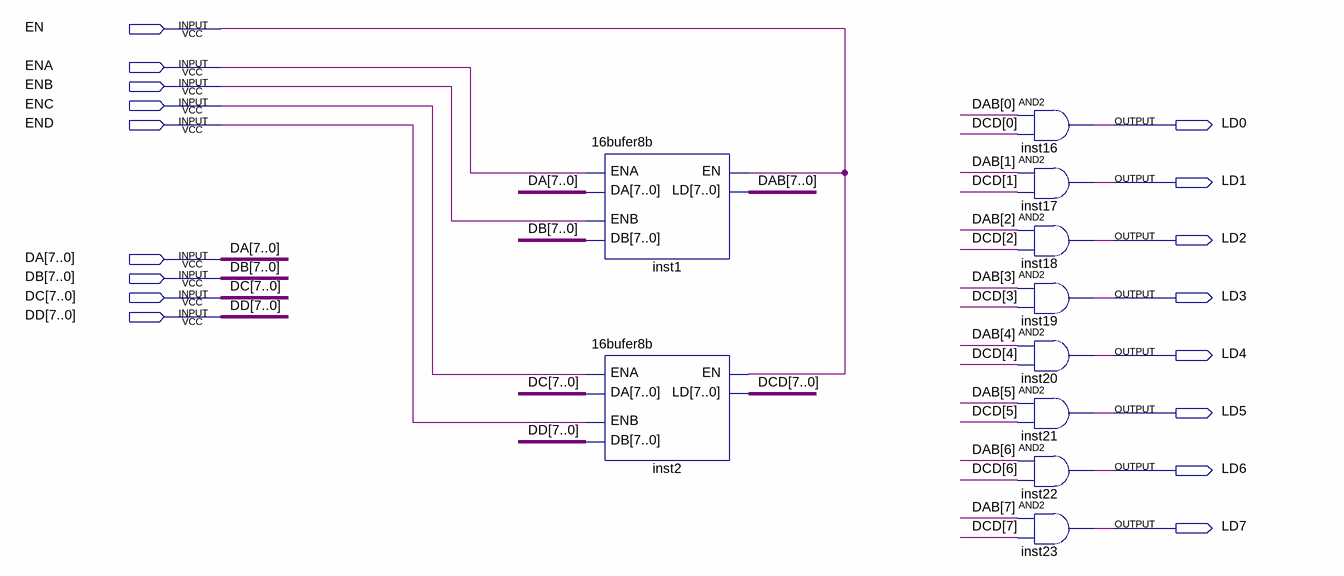
[diagram p0: schematic sheet]
// Quartus schematic 32bufer8b.bdf as structural Verilog: 10 symbols, 17 pins
module \32bufer8b  (
  input  EN,
  input  ENA,
  input  ENB,
  input  ENC,
  input  END,
  input  [7:0] DA,
  input  [7:0] DB,
  input  [7:0] DC,
  input  [7:0] DD,
  output LD0,
  output LD1,
  output LD2,
  output LD3,
  output LD4,
  output LD5,
  output LD6,
  output LD7
);

  wire [7:0] DAB, DCD;

  \16bufer8b  inst1 (.EN(EN), .ENA(ENA), .ENB(ENB), .DA(DA), .DB(DB), .LD(DAB));
  \16bufer8b  inst2 (.EN(EN), .ENA(ENC), .ENB(END), .DA(DC), .DB(DD), .LD(DCD));
  and inst16 (LD0, DAB[0], DCD[0]);
  and inst17 (LD1, DAB[1], DCD[1]);
  and inst18 (LD2, DAB[2], DCD[2]);
  and inst19 (LD3, DAB[3], DCD[3]);
  and inst20 (LD4, DAB[4], DCD[4]);
  and inst21 (LD5, DAB[5], DCD[5]);
  and inst22 (LD6, DAB[6], DCD[6]);
  and inst23 (LD7, DAB[7], DCD[7]);
endmodule
